# Altium project 2318_Métronome_Electronique.PrjPcb
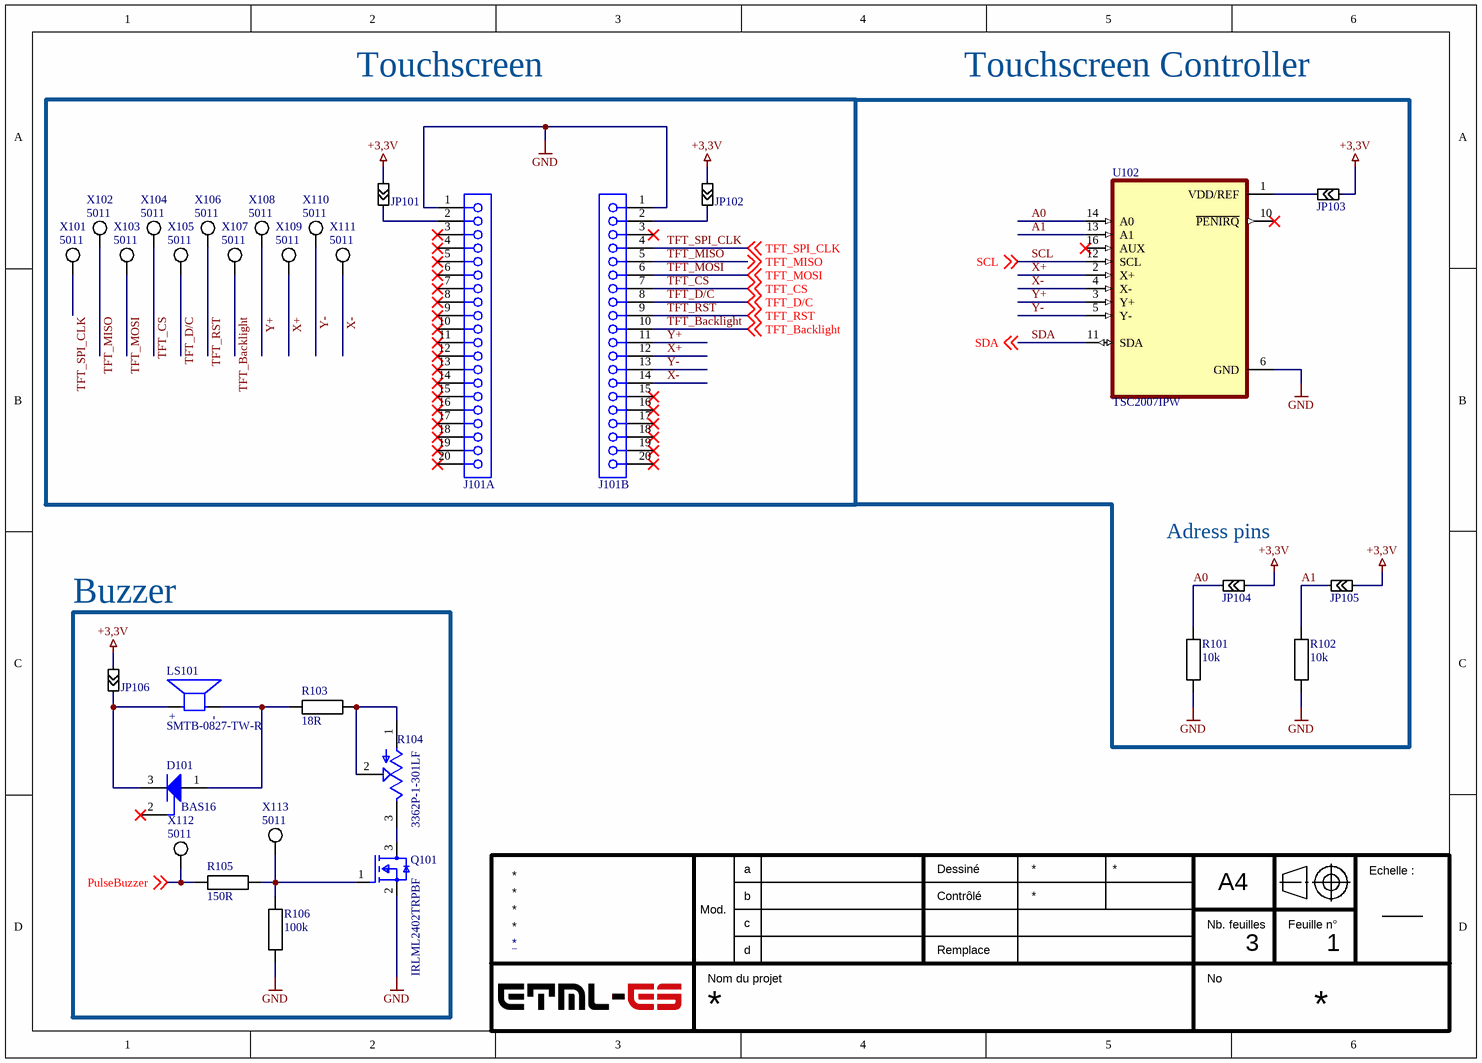
[diagram p0: General.SchDoc]
3 sheets, 125 parts. Net scope: global (net labels, ports and power ports of the same name join across sheets).
Board file: 2318_Metronome_A.PcbDoc
Sheets:
  General.SchDoc
  Microcontroleur.SchDoc
  Alimentation.SchDoc

## Sheet General.SchDoc
size 276 x 198 mm; SheetNumber: 1; SheetTotal: 3

### Parts
D101  BAS16  [INF-SOT23_L]
J101A  61302011821  [61302011821]  (value not drawn)
J101B  61302011821  [61302011821]  (value not drawn)
JP101  Jumper Pad  [Jumper SMD]  (value not drawn)
JP102  Jumper Pad  [Jumper SMD]  (value not drawn)
JP103  Jumper Pad  [Jumper SMD]  (value not drawn)
JP104  Jumper Pad  [Jumper SMD]  (value not drawn)
JP105  Jumper Pad  [Jumper SMD]  (value not drawn)
JP106  Jumper Pad  [Jumper SMD]  (value not drawn)
LS101  SMTB-0827-TW-R  [XDCR_SMTB-0827-TW-R]
Q101  IRLML2402TRPBF  [SOT95P237X112-3N]
R101  10k  [RESC2012X06M]
R102  10k  [RESC2012X06M]
R103  18R  [RESC2012X06M]
R104  3362P-1-301LF  [TRIM_3362P-1-301LF]
R105  150R  [RESC2012X06M]
R106  100k  [RESC2012X06M]
U102  TSC2007IPW  [SOP65P640X120-16N]
X101  5011  [Keystone_5011]
X102  5011  [Keystone_5011]
X103  5011  [Keystone_5011]
X104  5011  [Keystone_5011]
X105  5011  [Keystone_5011]
X106  5011  [Keystone_5011]
X107  5011  [Keystone_5011]
X108  5011  [Keystone_5011]
X109  5011  [Keystone_5011]
X110  5011  [Keystone_5011]
X111  5011  [Keystone_5011]
X112  5011  [Keystone_5011]
X113  5011  [Keystone_5011]

### Blocks framed on the sheet
Touchscreen: J101A J101B JP101 JP102 X101-X111
Buzzer: D101 JP106 LS101 Q101 R103-R106 X112 X113

### Nets
+3,3V: JP101.2 JP102.2 JP103.2 JP104.2 JP105.2 JP106.2
GND: J101A.1 J101B.1 Q101.2(S) R101.1 R102.1 R106.1 U102.6(GND)
A0: JP104.1 R101.2 U102.14(A0)
A1: JP105.1 R102.2 U102.13(A1)
PulseBuzzer: R105.1 X112.1(TP) ; off-sheet PulseBuzzer
SCL: U102.12(SCL) ; off-sheet SCL
SDA: U102.11(SDA) ; off-sheet SDA
TFT_Backlight: J101B.10 X107.1(TP) ; off-sheet TFT_Backlight
TFT_CS: J101B.7 X104.1(TP) ; off-sheet TFT_CS
TFT_D/C: J101B.8 X105.1(TP) ; off-sheet TFT_D/C
TFT_MISO: J101B.5 X102.1(TP) ; off-sheet TFT_MISO
TFT_MOSI: J101B.6 X103.1(TP) ; off-sheet TFT_MOSI
TFT_RST: J101B.9 X106.1(TP) ; off-sheet TFT_RST
TFT_SPI_CLK: J101B.4 X101.1(TP) ; off-sheet TFT_SPI_CLK
X+: J101B.12 U102.2(X+) X109.1(TP)
X-: J101B.14 U102.4(X-) X111.1(TP)
Y+: J101B.11 U102.3(Y+) X108.1(TP)
Y-: J101B.13 U102.5(Y-) X110.1(TP)
NetD101_1: D101.1(A) LS101.N(NEG) R103.2
NetD101_3: D101.3(K) JP106.1 LS101.P(POS)
NetJ101A_2: J101A.2 JP101.1
NetJ101B_2: J101B.2 JP102.1
NetJP103_1: JP103.1 U102.1(VDD/REF)
NetQ101_1: Q101.1(G) R105.2 R106.2 X113.1(TP)
NetQ101_3: Q101.3(D) R104.3(CW)
NetR103_1: R103.1 R104.1(CCW) R104.2(WIPER)

Not connected (* = marked no-connect by the designer): D101 2(NC)*; J101A 3* 4* 5* 6* 7* 8* 9* 10* 11* 12* 13* 14* 15* 16* 17* 18* 19* 20*; J101B 3* 15* 16* 17* 18* 19* 20*; U102 10(~{PENIRQ})* 16(AUX)*

### Notes on the sheet
- Touchscreen Controller
- Adress pins
- a
- Dessiné
- A4
- Echelle :
- Mod.
- b
- c
- d
- Contrôlé
- Remplace
- Nb. feuilles
- Feuille n°
- Nom du projet
- No
- (in symbol SMTB-0827-TW-R) +; -

### Library data of the parts
D101 = CMP-1176-00017-1: Silicon Switching Diode, SOT23, Reel, Green; Manufacturer: Infineon; VR (max): 80Â V; VBR (min): 85Â V; Configuration: Single; Green: TRUE; VF (max): 1.25Â V; trr (max): 4Â ns; IF (max): 250Â mA; IR (max): 100Â nA; ComponentLink3Description: Package Specification; PackageVersion: Apr-08; PackageReference: SOT23; ComponentLink2URL: http://www.infineon.com/dgdl/bas16series.pdf?folderId=db3a30431400ef6801141b5844e103ea&fileId=db3a30431400ef6801141b93811b03ff; Mounting Technology: Surface Mount; PartNumber: BAS16; ComponentLink2Description: Datasheet; ComponentLink1Description: Manufacturer URL; ComponentLink1URL: http://www.infineon.com/; ComponentLink3URL: http://www.infineon.com/dgdl/SOT23-Package_Overview.pdf?folderId=db3a30431936bc4b0119532290053c66&fileId=db3a30431936bc4b0119533468123c85; PackageDescription: 3-Pin Small Outline Transistor Package, 1.3 x 2.9 mm Body, 0.95 mm Pitch
J101A J101B = 61302011821: WR-PHD Socket Header, THT, Vertical, pitch 2.54mm, 1 Row, 20P; Manufacturer: Wurth Elektronik; Contact Resistance: 20mOhm; Rated Current: 3A; Working Voltage: 250V; Withstanding Voltage: 500V; Manufacturer Part Number: 61302011821; Category: Board-to-Board Connectors; Match Code: WR-PHD; ComponentLink1Description: Website Link; ComponentLink1URL: https://www.we-online.com/redexpert/article/61302011821?ad; ComponentLink2Description: Datasheet Link; ComponentLink2URL: https://www.we-online.com/redexpert/spec/61302011821?ad; Mount: Through Hole; Operating Temperature Max: 105°C; Operating Temperature Min: -40°C; Packaging: Tray; Gender: Socket Header; Number of Pins: 20; Number of Rows: 1; Orientation: Vertical; Pitch: 2.54mm
JP101-JP106 = Jumper Pad: SMD Jumper
LS101 = SMTB-0827-TW-R: SURFACE MOUNT TRANSDUCER 3.6 V0-P; MF: PUI Audio, Inc.; Purchase-URL: https://pricing.snapeda.com/search/part/SMTB-0827-TW-R/?ref=eda; Package: None; Digi-Key_Part_Number: 668-SMTB-0827-TW-RTR-ND; MP: SMTB-0827-TW-R; Check_prices: https://www.snapeda.com/parts/SMTB-0827-TW-R/PUI+Audio%252C+Inc./view-part/?ref=eda; SnapEDA_Link: https://www.snapeda.com/parts/SMTB-0827-TW-R/PUI+Audio%252C+Inc./view-part/?ref=snap; Value: *
Q101 = IRLML2402TRPBF: MOSFET N-CH 20V 1.2A SOT-23; Max Power Dissipation: 540mW; Gate to Source Voltage (Vgs): 12V; Drain to Source Resistance: 350mR; Rise Time: 9.5ns; Threshold Voltage: 700mV; Turn-On Delay Time: 2.5ns; Input Capacitance: 110pF; Element Configuration: Single; Power Dissipation: 540W; Turn-Off Delay Time: 9.7ns; Rds On Max: 250mR; REACH SVHC: No SVHC; Mount: Surface Mount; Packaging: Tape and Reel; Height: 0.04inch; Drain to Source Voltage (Vdss): 20V; Length: 0.119inch; Contact Plating: Tin; Continuous Drain Current (ID): 1.2A; Lead Free: Lead Free; Drain to Source Breakdown Voltage: 20V; Max Dual Supply Voltage: 20V; Number of Pins: 3; Halogen Free: Halogen Free; Max Operating Temperature: 150°C; Case/Package: SOT-23; Min Operating Temperature: -55°C; Width: 0.055inch
R101 R102 = CMP-066-000199-2: RES 10kohm  ±1% 0.125W 2012 (0805 INCH); Manufacturer Number: RC0805FR-0710KL; Manufacturer: Yageo; PN: PN-374909; TemperatureCoeff: ±200ppm/°C; Voltage: 150V; TemperatureRange: -55°C to 155°C; IsStocked: 1; Tolerance: ±1%; Category: Passives; Value: 10k; Supplier Price 1: 0.0200; Supplier Part Number 1: FAB.0805_R 10k; Supplier 1: ETML; SubCategory: Resistances couche epaisse; Power: 0.125W
R103 = CMP-066-000166-2: RES 18ohm  ±1% 0.125W 2012 (0805 INCH); Manufacturer: Yageo; Manufacturer Number: RC0805FR-0718RL; TemperatureRange: -55°C to 155°C; TemperatureCoeff: ±200ppm/°C; Voltage: 150V; Value: 18; PN: PN-496535; IsStocked: 1; Category: Passives; Power: 0.125W; Supplier Price 1: 0.0200; Tolerance: ±1%; Supplier 1: ETML; Supplier Part Number 1: FAB.0805_R 18R; SubCategory: Resistances couche epaisse
R104 = 3362P-1-301LF: 300 Ohms 0.5W, 1/2W PC Pins Through Hole Trimmer Potentiometer Cermet 1 Turn Top Adjustment; MF: Bourns; Package: 3362P-1 Bourns Inc.; Price: None; Availability: Bad; Check_prices: https://www.snapeda.com/parts/3362P-1-301LF/Bourns/view-part/620352/?ref=eda; MP: 3362P-1-301LF; SnapEDA_Link: https://www.snapeda.com/parts/3362P-1-301LF/Bourns/view-part/620352/?ref=snap; Value: *
R105 = CMP-066-000177-2: RES 150ohm  ±1% 0.125W 2012 (0805 INCH); Manufacturer: Yageo; Manufacturer Number: RC0805FR-07150RL; Value: 150; TemperatureRange: -55°C to 155°C; Voltage: 150V; TemperatureCoeff: ±200ppm/°C; PN: PN-455993; IsStocked: 1; Supplier Price 1: 0.0200; Tolerance: ±1%; SubCategory: Resistances couche epaisse; Power: 0.125W; Supplier Part Number 1: FAB.0805_R 150R; Supplier 1: ETML; Category: Passives
R106 = CMP-066-000211-2: RES 100kohm  ±1% 0.125W 2012 (0805 INCH); Manufacturer: Yageo; Manufacturer Number: RC0805FR-07100KL; TemperatureCoeff: ±200ppm/°C; Voltage: 150V; TemperatureRange: -55°C to 155°C; IsStocked: 1; PN: PN-903408; Category: Passives; Supplier Part Number 1: FAB.0805_R 100k; Value: 100k; Tolerance: ±1%; Supplier Price 1: 0.0200; Power: 0.125W; SubCategory: Resistances couche epaisse; Supplier 1: ETML
U102 = TSC2007IPW: 12-Bit, nanopower, 4-wire micro touch screen controller &nbsp; 16-TSSOP -40 to 85; MF: Texas Instruments; Digi-Key_Part_Number: 296-42398-2-ND; Purchase-URL: https://pricing.snapeda.com/search/part/TSC2007IPW/?ref=eda; Package: TSSOP-16 Texas Instruments; MP: TSC2007IPW; Value: *; SnapEDA_Link: https://www.snapeda.com/parts/TSC2007IPW/Texas%20Instruments/view-part/291616/?ref=snap; Check_prices: https://www.snapeda.com/parts/TSC2007IPW/Texas%20Instruments/view-part/291616/?ref=eda
X101-X113 = CMP-054-000005-1: TEST THT MULTIPURPOSE BK; Manufacturer: Keystone; IsStocked: True; PN: PN-926990; Supplier 1: ETML; Value: 5011; Manufacturer Number: 5011; Supplier Part Number 1: MAG.428.014; Category: Connectors; SubCategory: Testpoints; Supplier Price 1: 0.2439

## Sheet Microcontroleur.SchDoc
size 408 x 276 mm; SheetNumber: 2; SheetTotal: 3
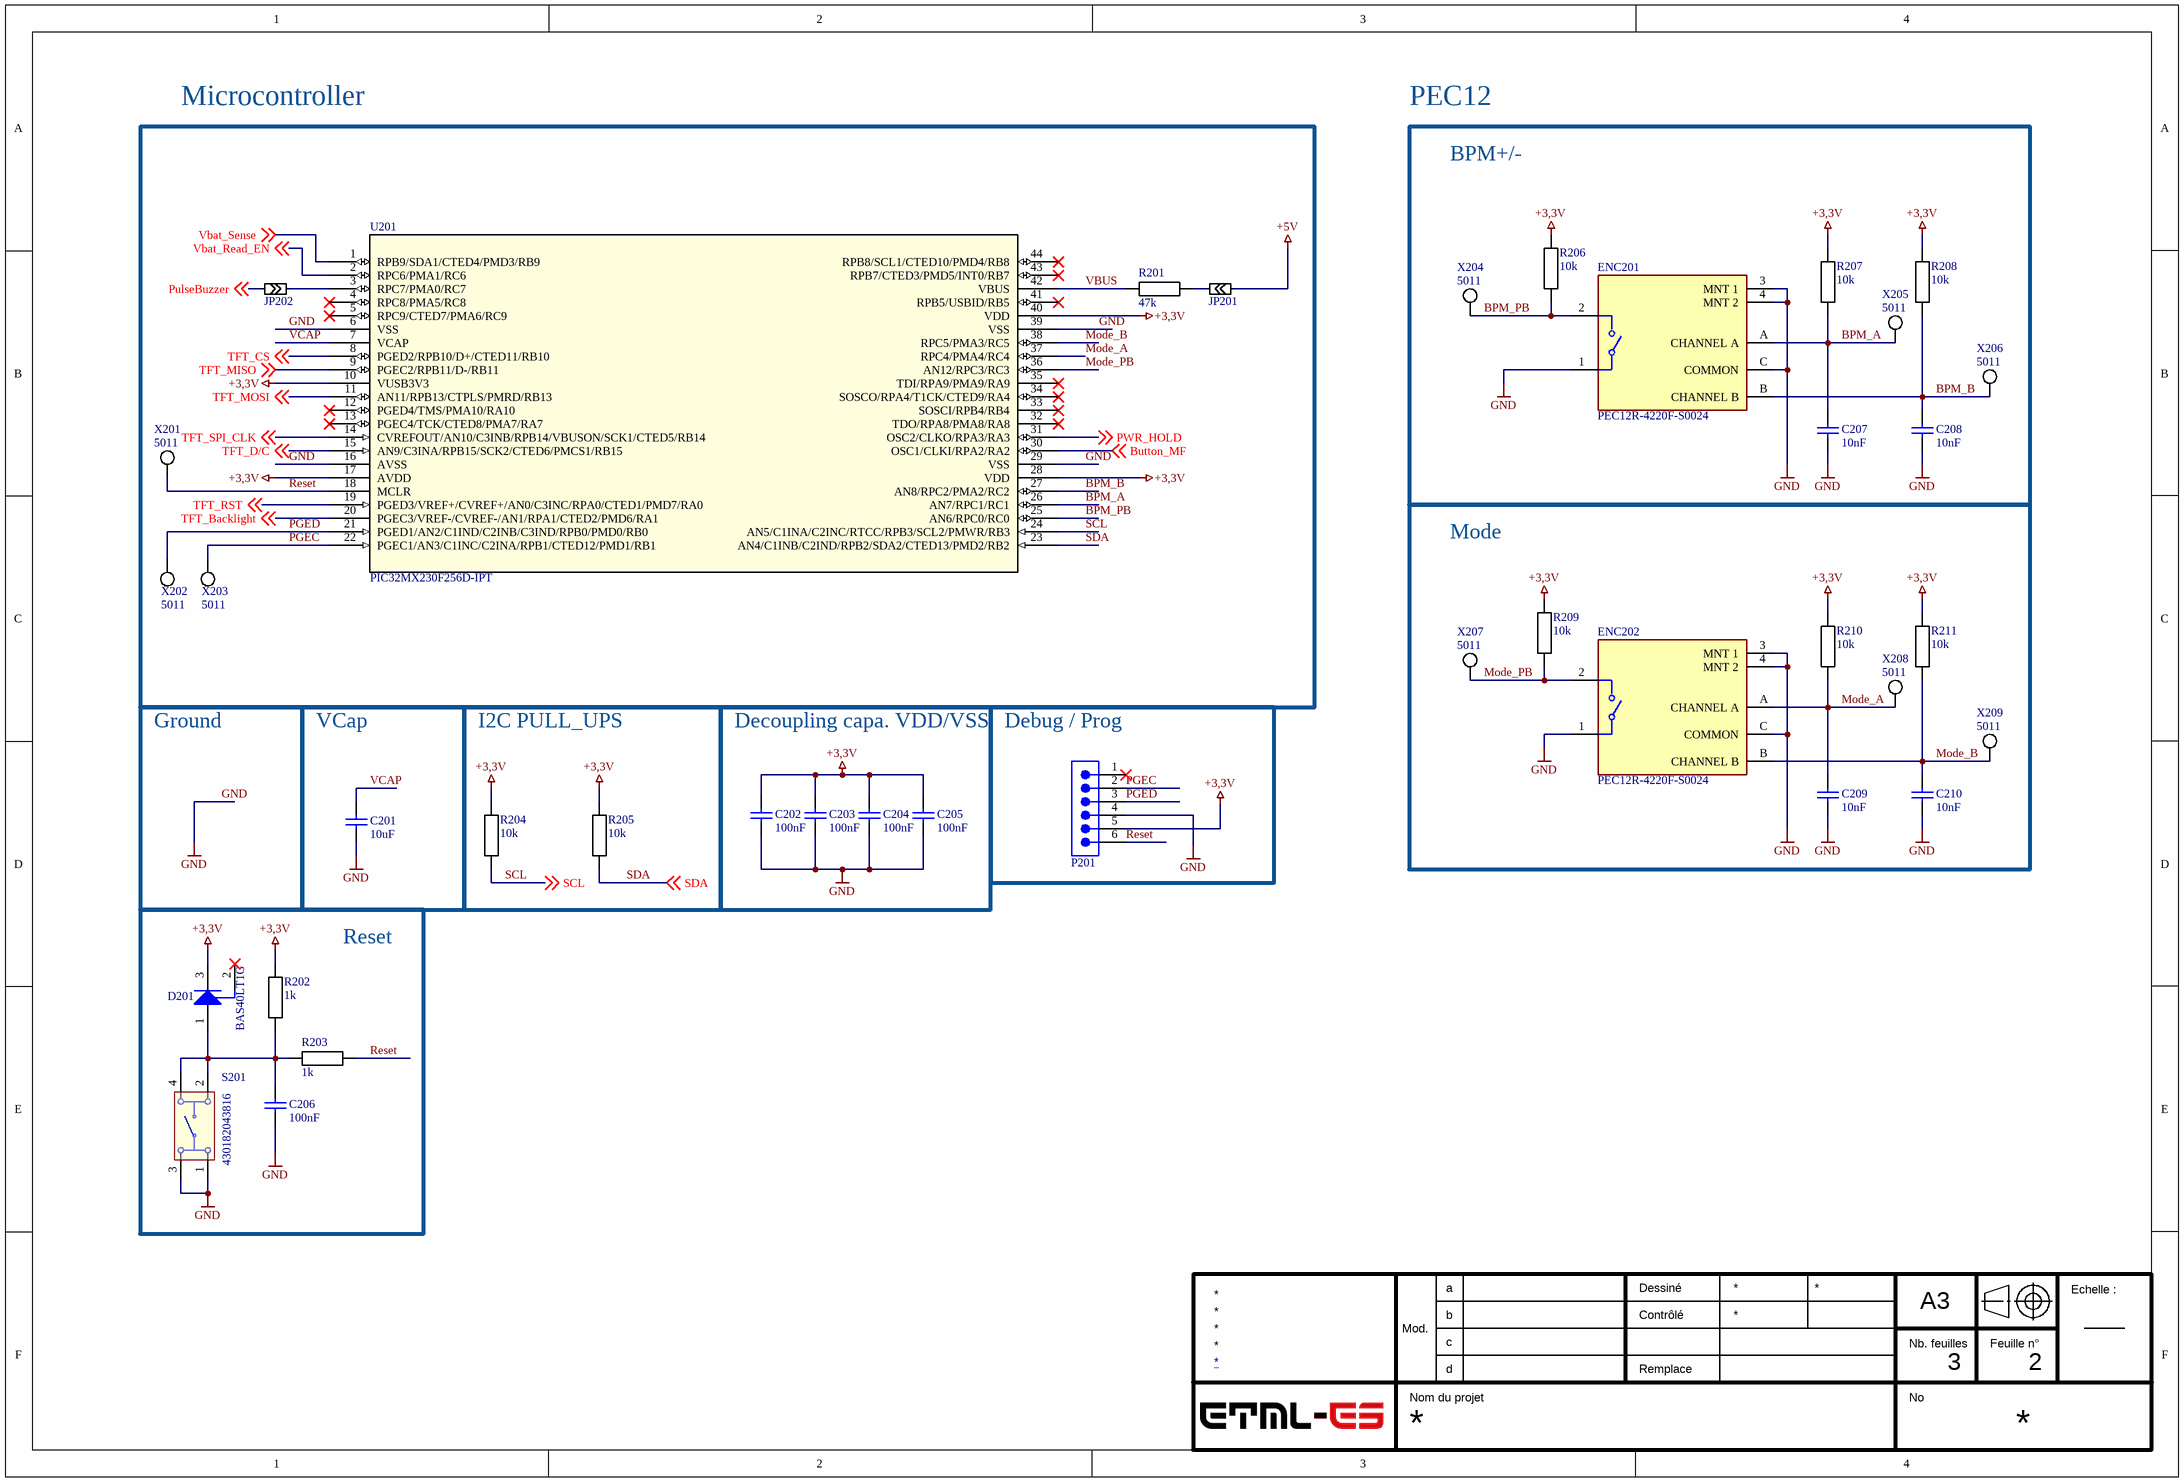
[diagram p1: Microcontroleur.SchDoc]

### Parts
C201  value 10uF  [CAPC2012X08M]  (hidden comment: Cap)
C202  value 100nF  [CAPC2012X08M]  (hidden comment: Cap)
C203  value 100nF  [CAPC2012X08M]  (hidden comment: Cap)
C204  value 100nF  [CAPC2012X08M]  (hidden comment: Cap)
C205  value 100nF  [CAPC2012X08M]  (hidden comment: Cap)
C206  value 100nF  [CAPC2012X08M]  (hidden comment: Cap)
C207  value 10nF  [CAPC2012X08M]  (hidden comment: Cap)
C208  value 10nF  [CAPC2012X08M]  (hidden comment: Cap)
C209  value 10nF  [CAPC2012X08M]  (hidden comment: Cap)
C210  value 10nF  [CAPC2012X08M]  (hidden comment: Cap)
D201  BAS40LT1G  [ONSC-SOT-23-3-318-08_V]
ENC201  PEC12R-4220F-S0024  [FP-PEC12R-4220F-S0024-MFG]
ENC202  PEC12R-4220F-S0024  [FP-PEC12R-4220F-S0024-MFG]
JP201  Jumper Pad  [Jumper SMD]  (value not drawn)
JP202  Jumper Pad  [Jumper SMD]  (value not drawn)
P201  61300611121  [61300611121]  (value not drawn)
R201  47k  [RESC2012X06M]
R202  1k  [RESC2012X06M]
R203  1k  [RESC2012X06M]
R204  10k  [RESC2012X06M]
R205  10k  [RESC2012X06M]
R206  10k  [RESC2012X06M]
R207  10k  [RESC2012X06M]
R208  10k  [RESC2012X06M]
R209  10k  [RESC2012X06M]
R210  10k  [RESC2012X06M]
R211  10k  [RESC2012X06M]
S201  430182043816  [430182043816]
U201  PIC32MX230F256D-IPT  [TQFP44_PT_MCH]
X201  5011  [Keystone_5011]
X202  5011  [Keystone_5011]
X203  5011  [Keystone_5011]
X204  5011  [Keystone_5011]
X205  5011  [Keystone_5011]
X206  5011  [Keystone_5011]
X207  5011  [Keystone_5011]
X208  5011  [Keystone_5011]
X209  5011  [Keystone_5011]

### Blocks framed on the sheet
Microcontroller: JP201 JP202 R201 U201 X201-X203
PEC12: C207-C210 ENC201 ENC202 R206-R211 X204-X209
VCap: C201
I2C PULL_UPS: R204 R205
Decoupling capa. VDD/VSS: C202-C205
Debug / Prog: P201
Reset: C206 D201 R202 R203 S201

### Nets
+3,3V: C202.2 C203.2 C204.2 C205.2 D201.3(K) P201.5 R202.2 R204.2 R205.2 R206.1 R207.2 R208.2 R209.1 R210.2 R211.2 U201.10(VUSB3V3) U201.17(AVDD) U201.28(VDD) U201.40(VDD)
+5V: JP201.2
GND: C201.1 C202.1 C203.1 C204.1 C205.1 C206.1 C207.1 C208.1 C209.1 C210.1 ENC201.1 ENC201.3(MNT_1) ENC201.4(MNT_2) ENC201.C(COMMON) ENC202.1 ENC202.3(MNT_1) ENC202.4(MNT_2) ENC202.C(COMMON) P201.4 S201.1 S201.3 U201.6(VSS) U201.16(AVSS) U201.29(VSS) U201.39(VSS)
BPM_A: C207.2 ENC201.A(CHANNEL_A) R207.1 U201.26(AN7/RPC1/RC1) X205.1(TP)
BPM_B: C208.2 ENC201.B(CHANNEL_B) R208.1 U201.27(AN8/RPC2/PMA2/RC2) X206.1(TP)
BPM_PB: ENC201.2 R206.2 U201.25(AN6/RPC0/RC0) X204.1(TP)
Button_MF: U201.30(OSC1/CLKI/RPA2/RA2) ; off-sheet Button_MF
Mode_A: C209.2 ENC202.A(CHANNEL_A) R210.1 U201.37(RPC4/PMA4/RC4) X208.1(TP)
Mode_B: C210.2 ENC202.B(CHANNEL_B) R211.1 U201.38(RPC5/PMA3/RC5) X209.1(TP)
Mode_PB: ENC202.2 R209.2 U201.36(AN12/RPC3/RC3) X207.1(TP)
PGEC: P201.2 U201.22(PGEC1/AN3/C1INC/C2INA/RPB1/CTED12/PMD1/RB1) X203.1(TP)
PGED: P201.3 U201.21(PGED1/AN2/C1IND/C2INB/C3IND/RPB0/PMD0/RB0) X202.1(TP)
PulseBuzzer: JP202.2 ; off-sheet PulseBuzzer
PWR_HOLD: U201.31(OSC2/CLKO/RPA3/RA3) ; off-sheet PWR_HOLD
Reset: P201.6 R203.1 U201.18(MCLR) X201.1(TP)
SCL: R204.1 U201.24(AN5/C1INA/C2INC/RTCC/RPB3/SCL2/PMWR/RB3) ; off-sheet SCL
SDA: R205.1 U201.23(AN4/C1INB/C2IND/RPB2/SDA2/CTED13/PMD2/RB2) ; off-sheet SDA
TFT_Backlight: U201.20(PGEC3/VREF-/CVREF-/AN1/RPA1/CTED2/PMD6/RA1) ; off-sheet TFT_Backlight
TFT_CS: U201.8(PGED2/RPB10/D+/CTED11/RB10) ; off-sheet TFT_CS
TFT_D/C: U201.15(AN9/C3INA/RPB15/SCK2/CTED6/PMCS1/RB15) ; off-sheet TFT_D/C
TFT_MISO: U201.9(PGEC2/RPB11/D-/RB11) ; off-sheet TFT_MISO
TFT_MOSI: U201.11(AN11/RPB13/CTPLS/PMRD/RB13) ; off-sheet TFT_MOSI
TFT_RST: U201.19(PGED3/VREF+/CVREF+/AN0/C3INC/RPA0/CTED1/PMD7/RA0) ; off-sheet TFT_RST
TFT_SPI_CLK: U201.14(CVREFOUT/AN10/C3INB/RPB14/VBUSON/SCK1/CTED5/RB14) ; off-sheet TFT_SPI_CLK
Vbat_Read_EN: U201.2(RPC6/PMA1/RC6) ; off-sheet Vbat_Read_EN
Vbat_Sense: U201.1(RPB9/SDA1/CTED4/PMD3/RB9) ; off-sheet Vbat_Sense
VBUS: R201.1 U201.42(VBUS)
VCAP: C201.2 U201.7(VCAP)
NetC206_2: C206.2 D201.1(A) R202.1 R203.2 S201.2 S201.4
NetJP201_1: JP201.1 R201.2
NetJP202_1: JP202.1 U201.3(RPC7/PMA0/RC7)

Not connected (* = marked no-connect by the designer): D201 2(NC)*; P201 1*; U201 4(RPC8/PMA5/RC8)* 5(RPC9/CTED7/PMA6/RC9)* 12(PGED4/TMS/PMA10/RA10)* 13(PGEC4/TCK/CTED8/PMA7/RA7)* 32(TDO/RPA8/PMA8/RA8)* 33(SOSCI/RPB4/RB4)* 34(SOSCO/RPA4/T1CK/CTED9/RA4)* 35(TDI/RPA9/PMA9/RA9)* 41(RPB5/USBID/RB5)* 43(RPB7/CTED3/PMD5/INT0/RB7)* 44(RPB8/SCL1/CTED10/PMD4/RB8)*

### Notes on the sheet
- BPM+/-
- Mode
- Ground
- a
- Dessiné
- A3
- Echelle :
- Mod.
- b
- c
- d
- Contrôlé
- Remplace
- Nb. feuilles
- Feuille n°
- Nom du projet
- No

### Library data of the parts
C201-C210 = Cap: Capacitor; Published: 8-Jun-2000; LatestRevisionDate: 17-Jul-2002; LatestRevisionNote: Re-released for DXP Platform.; PackageReference: RAD-0.3; Publisher: Altium Limited; PackageDescription: Radial Cap, Thru-Hole; 2 Leads; 0.3 in Pin Spacing
D201 = CMP-1055-00540-1: Schottky Barrier Diode, 3-Pin SOT-23, Pb-Free, Tape and Reel; Manufacturer: On Semiconductor; Configuration: Single; ComponentLink3Description: Package Specification; ComponentLink1URL: http://www.onsemi.com/; ComponentLink2Description: Datasheet; PackageDescription: 3-Pin Small Outline Transistor, Body 2.92 x 1.3 mm, Pitch 0.95 mm; ComponentLink3URL: http://www.onsemi.cn/pub_link/Collateral/318-08.PDF; PartNumber: BAS40LT1G; DatasheetVersion: Rev. 10; Packing: Tape and Reel; PackageReference: SOT-23-3-318-08; ComponentLink1Description: Manufacturer URL; ComponentLink2URL: http://www.onsemi.cn/pub_link/Collateral/BAS40LT1-D.PDF; RoHS: TRUE; Mounting Technology: Surface Mount; PackageVersion: Rev. AP, 11/2009
ENC201 ENC202 = CMP-07421-000021-1: ROTARY ENCODER MECHANICAL 24PPR; Built in Switch: Yes; Pulses per Revolution: 24; Output Type: Quadrature; Hole Diameter: 2mm; Number of Channels: 2; Max Supply Voltage (DC): 5V; RoHS Compliant: Yes; Max Operating Temperature: 70°C; Length: 26mm; Width: 12.5mm; Encoder Type: Mechanical; Series: PEC12R; Mount: Through Hole; Height: 13.4mm; Packaging: Bulk; Package Quantity: 150; Termination: PC Pin; Min Operating Temperature: -30°C; REACH SVHC: No SVHC; Detent: Yes; Orientation: Vertical
JP201 JP202 = Jumper Pad: SMD Jumper
P201 = 61300611121: WR-PHD Pin Header, THT, Vertical, pitch 2.54mm, 1 Row, 6P; Manufacturer: Wurth Elektronik; Contact Resistance: 20mOhm; Rated Current: 3A; Working Voltage: 250V; Withstanding Voltage: 500V; Manufacturer Part Number: 61300611121; Category: Board-to-Board Connectors; Match Code: WR-PHD; ComponentLink1Description: Website Link; ComponentLink1URL: https://www.we-online.com/redexpert/article/61300611121?ad; ComponentLink2Description: Datasheet Link; ComponentLink2URL: https://www.we-online.com/redexpert/spec/61300611121?ad; Mount: Through Hole; Operating Temperature Max: 105°C; Operating Temperature Min: -40°C; Packaging: Bag; Gender: Pin Header; Number of Pins: 6; Number of Rows: 1; Orientation: Vertical; Pitch: 2.54mm
R201 = CMP-066-000207-2: RES 47kohm  ±1% 0.125W 2012 (0805 INCH); Manufacturer Number: RC0805FR-0747KL; Manufacturer: Yageo; TemperatureRange: -55°C to 155°C; Voltage: 150V; IsStocked: 1; TemperatureCoeff: ±200ppm/°C; PN: PN-427242; Category: Passives; Supplier Price 1: 0.0200; Power: 0.125W; Supplier 1: ETML; Tolerance: ±1%; SubCategory: Resistances couche epaisse; Supplier Part Number 1: FAB.0805_R 47k; Value: 47k
R202 R203 = CMP-066-000187-2: RES 1.0kohm  ±1% 0.125W 2012 (0805 INCH); Manufacturer: Yageo; Manufacturer Number: RC0805FR-071KL; PN: PN-746409; TemperatureRange: -55°C to 155°C; IsStocked: 1; TemperatureCoeff: ±200ppm/°C; Voltage: 150V; Supplier 1: ETML; Value: 1k; SubCategory: Resistances couche epaisse; Supplier Price 1: 0.0200; Supplier Part Number 1: FAB.0805_R 1k0; Category: Passives; Tolerance: ±1%; Power: 0.125W
R204 R205 = CMP-066-000199-2: as R101 on sheet General; Tolerance: ±1%; Category: Passives; Value: 10k; Supplier Price 1: 0.0200; Supplier Part Number 1: FAB.0805_R 10k; Supplier 1: ETML; SubCategory: Resistances couche epaisse; Power: 0.125W
R206-R211 = R: Resistor 0805 M; Supplier 1: ETML; Supplier 1 Price: 0.00
S201 = CMP-1452-00013-1: WS-TASV SMD Tact Switch 6X6 mm; Manufacturer: Wuerth Elektronik; NoPins: 04; ComponentLink2Description: Datasheet; PackageReference: 430182043816; ComponentLink2URL: http://katalog.we-online.de/em/datasheet/4301x2.pdf; ComponentLink1URL: http://www.we-online.com; PartNumber: 430182043816; ComponentLink1Description: Manufacturer URL
U201 = PIC32MX230F256D-IPT: No Description Available; Mfr_Name: Microchip; RefDes: RefDes; Type: Type
X201-X209 = CMP-054-000005-1: as X101 on sheet General; Supplier 1: ETML; Value: 5011; Manufacturer Number: 5011; Supplier Part Number 1: MAG.428.014; Category: Connectors; SubCategory: Testpoints; Supplier Price 1: 0.2439

## Sheet Alimentation.SchDoc
size 408 x 276 mm; SheetNumber: 3; SheetTotal: 3
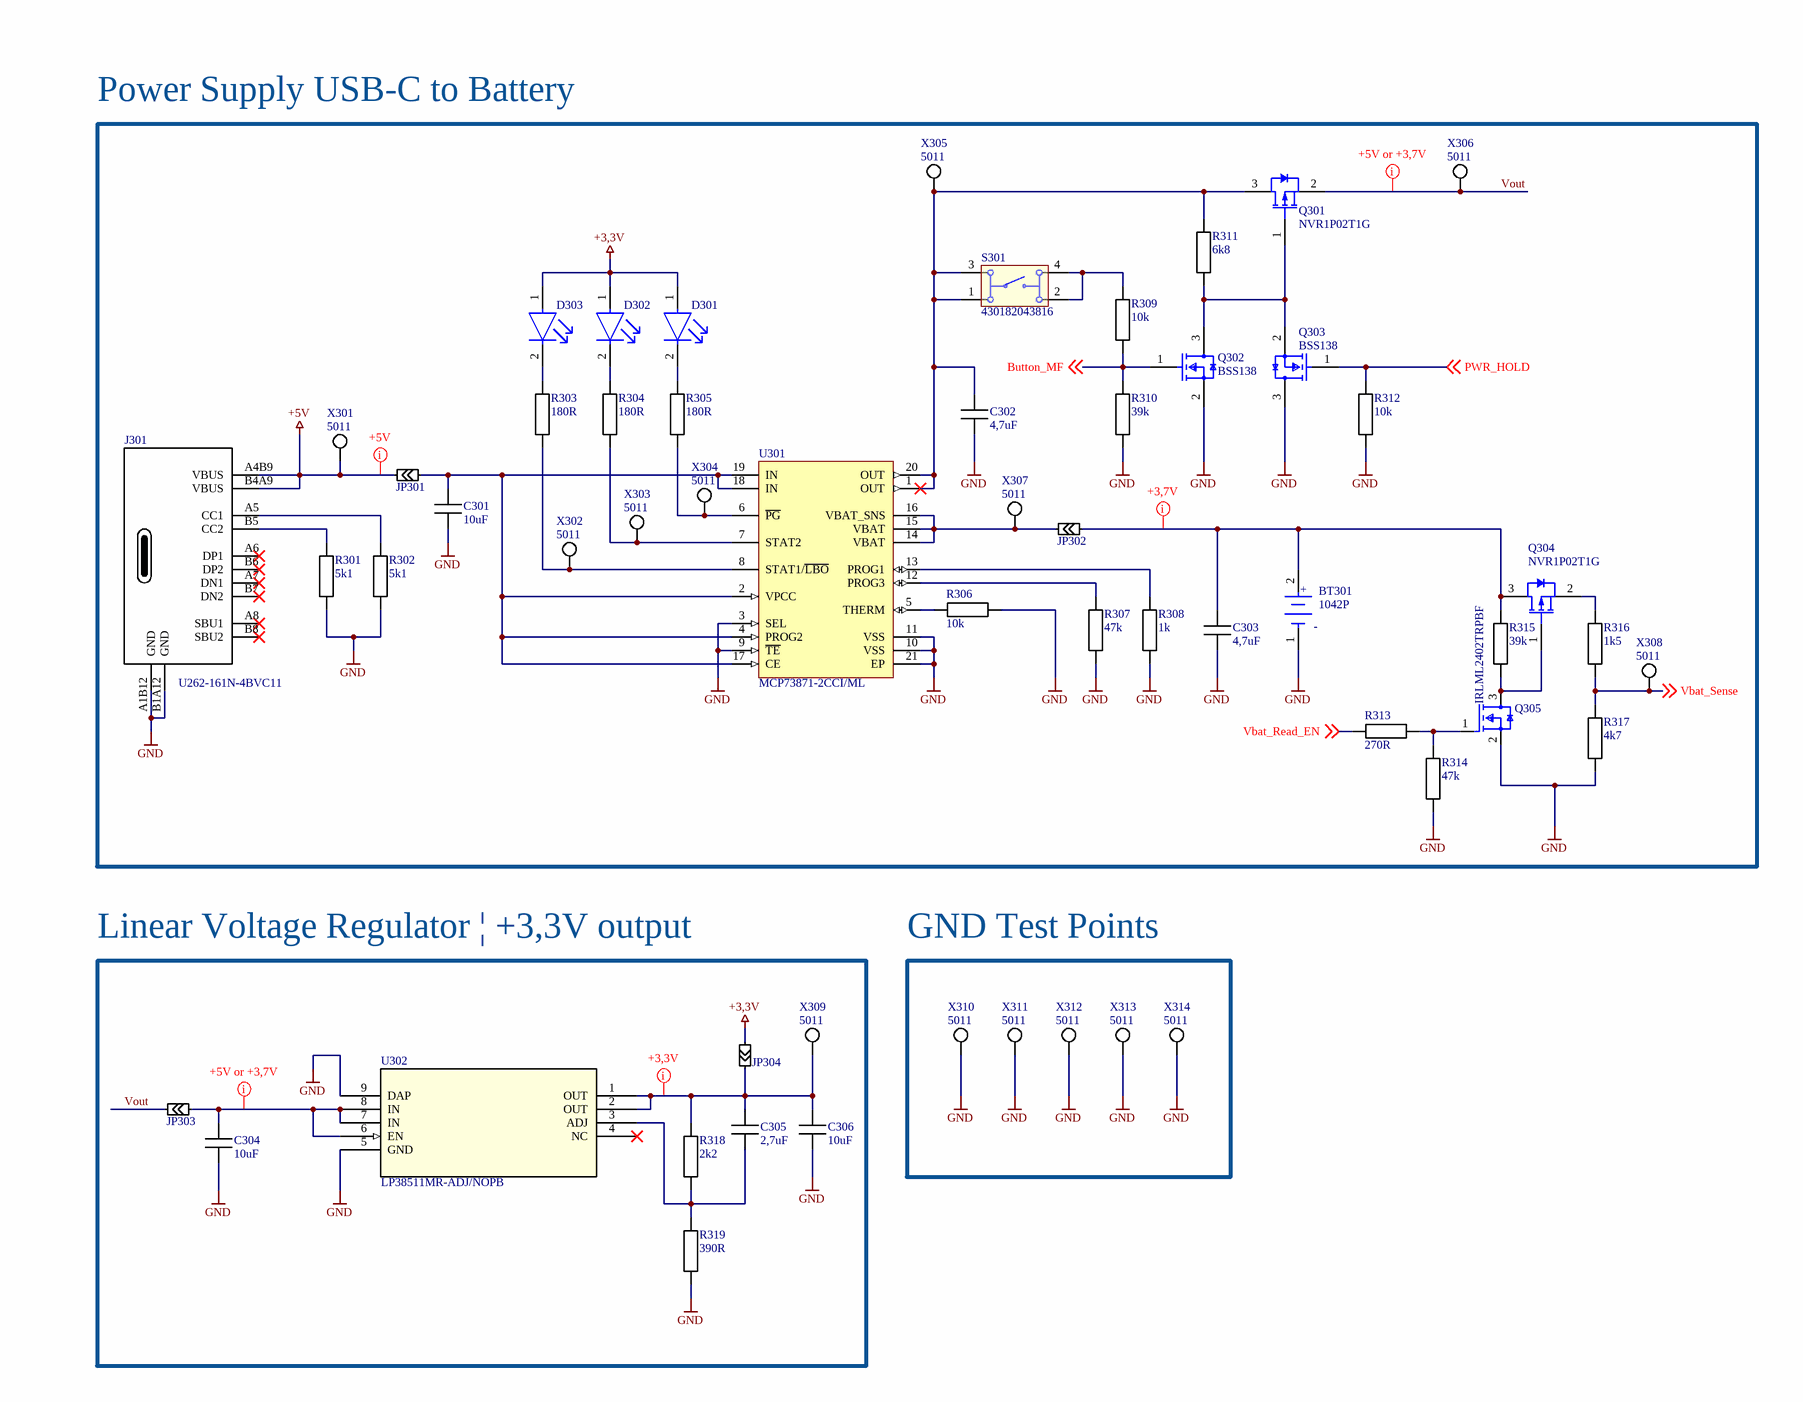
[diagram p2: Alimentation.SchDoc, right]

### Parts
BT301  1042P  [FP-1042P-MFG]
C301  10uF  [CAPC2012X08M]
C302  4,7uF  [CAPC2012X08M]
C303  4,7uF  [CAPC2012X08M]
C304  10uF  [CAPC2012X08M]
C305  2,7uF  [CAPC2012X08M]
C306  10uF  [CAPC2012X08M]
D301  LH R974-LP-1  [FP-LH_R974-MFG]  (value not drawn)
D302  LH R974-LP-1  [FP-LH_R974-MFG]  (value not drawn)
D303  LH R974-LP-1  [FP-LH_R974-MFG]  (value not drawn)
J301  U262-161N-4BVC11  [GCT_USB4105-GF-A]
JP301  Jumper Pad  [Jumper SMD]  (value not drawn)
JP302  Jumper Pad  [Jumper SMD]  (value not drawn)
JP303  Jumper Pad  [Jumper SMD]  (value not drawn)
JP304  Jumper Pad  [Jumper SMD]  (value not drawn)
Q301  NVR1P02T1G  [SOT95P237X112-3N]
Q302  BSS138  [SOT95P237X112-3N]
Q303  BSS138  [SOT95P237X112-3N]
Q304  NVR1P02T1G  [SOT95P237X112-3N]
Q305  IRLML2402TRPBF  [SOT95P237X112-3N]
R301  5k1  [RESC2012X06M]
R302  5k1  [RESC2012X06M]
R303  180R  [RESC2012X06M]
R304  180R  [RESC2012X06M]
R305  180R  [RESC2012X06M]
R306  10k  [RESC2012X06M]
R307  47k  [RESC2012X06M]
R308  1k  [RESC2012X06M]
R309  10k  [RESC2012X06M]
R310  39k  [RESC2012X06M]
R311  6k8  [RESC2012X06M]
R312  10k  [RESC2012X06M]
R313  270R  [RESC2012X06M]
R314  47k  [RESC2012X06M]
R315  39k  [RESC2012X06M]
R316  1k5  [RESC2012X06M]
R317  4k7  [RESC2012X06M]
R318  2k2  [RESC2012X06M]
R319  390R  [RESC2012X06M]
S301  430182043816  [430182043816]
U301  MCP73871-2CCI/ML  [QFN-ML20_M]
U302  LP38511MR-ADJ/NOPB  [MRA08B]
X301  5011  [Keystone_5011]
X302  5011  [Keystone_5011]
X303  5011  [Keystone_5011]
X304  5011  [Keystone_5011]
X305  5011  [Keystone_5011]
X306  5011  [Keystone_5011]
X307  5011  [Keystone_5011]
X308  5011  [Keystone_5011]
X309  5011  [Keystone_5011]
X310  5011  [Keystone_5011]
X311  5011  [Keystone_5011]
X312  5011  [Keystone_5011]
X313  5011  [Keystone_5011]
X314  5011  [Keystone_5011]

### Blocks framed on the sheet
Power Supply USB-C to Battery: BT301 C301-C303 D301-D303 J301 JP301 JP302 Q301-Q305 R301-R317 S301 U301 X301-X308
Linear Voltage Regulator | +3,3V output: C304-C306 JP303 JP304 R318 R319 U302 X309
GND Test Points: X310-X314

### Nets
+3,3V: D301.1(A) D302.1(A) D303.1(A) JP304.2
+5V: J301.A4B9(VBUS) J301.B4A9(VBUS) JP301.1 X301.1(TP)
GND: BT301.1(C) C301.1 C302.1 C303.1 C304.1 C306.1 J301.A1B12(GND) J301.B1A12(GND) Q302.2(S) Q303.3(D) Q305.2(S) R301.1 R302.1 R306.1 R307.2 R308.1 R310.1 R312.2 R314.1 R317.1 R319.1 U301.3(SEL) U301.9(~{TE}) U301.10(VSS) U301.11(VSS) U301.21(EP) U302.5(GND) U302.9(DAP) X310.1(TP) X311.1(TP) X312.1(TP) X313.1(TP) X314.1(TP)
Button_MF: Q302.1(G) R309.2 R310.2 ; off-sheet Button_MF
PWR_HOLD: Q303.1(G) R312.1 ; off-sheet PWR_HOLD
Vbat_Read_EN: R313.2 ; off-sheet Vbat_Read_EN
Vbat_Sense: R316.1 R317.2 X308.1(TP) ; off-sheet Vbat_Sense
Vout: JP303.1 Q301.2(S) X306.1(TP)
NetBT301_2: BT301.2(A) C303.2 JP302.2 Q304.3(D) R315.2
NetC301_2: C301.2 JP301.2 U301.2(VPCC) U301.4(PROG2) U301.17(CE) U301.18(IN) U301.19(IN)
NetC302_2: C302.2 Q301.3(D) R311.2 S301.1 S301.3 U301.1(OUT) U301.20(OUT) X305.1(TP)
NetC304_2: C304.2 JP303.2 U302.6(EN) U302.7(IN) U302.8(IN)
NetC305_1: C305.1 R318.1 R319.2 U302.3(ADJ)
NetC305_2: C305.2 C306.2 JP304.1 R318.2 U302.1(OUT) U302.2(OUT) X309.1(TP)
NetD301_2: D301.2(C) R305.2
NetD302_2: D302.2(C) R304.2
NetD303_2: D303.2(C) R303.2
NetJ301_A5: J301.A5(CC1) R302.2
NetJ301_B5: J301.B5(CC2) R301.2
NetJP302_1: JP302.1 U301.14(VBAT) U301.15(VBAT) U301.16(VBAT_SNS) X307.1(TP)
NetQ301_1: Q301.1(G) Q302.3(D) Q303.2(S) R311.1
NetQ304_1: Q304.1(G) Q305.3(D) R315.1
NetQ304_2: Q304.2(S) R316.2
NetQ305_1: Q305.1(G) R313.1 R314.2
NetR303_1: R303.1 U301.8(STAT1/~{LBO}) X302.1(TP)
NetR304_1: R304.1 U301.7(STAT2) X303.1(TP)
NetR305_1: R305.1 U301.6(~{PG}) X304.1(TP)
NetR306_2: R306.2 U301.5(THERM)
NetR307_1: R307.1 U301.12(PROG3)
NetR308_2: R308.2 U301.13(PROG1)
NetR309_1: R309.1 S301.2 S301.4

Not connected (* = marked no-connect by the designer): J301 A6(DP1)* A7(DN1)* A8(SBU1)* B6(DP2)* B7(DN2)* B8(SBU2)*; U302 4(NC)*

### Layout directives
mark named +5V or +3,7V: NetC304_2, Vout
mark named +3,7V: NetBT301_2
mark named +5V: +5V
mark named +3,3V: NetC305_2

### Notes on the sheet
- a
- Dessiné
- A3
- Echelle :
- Mod.
- b
- c
- d
- Contrôlé
- Remplace
- Nb. feuilles
- Feuille n°
- Nom du projet
- No
- (in symbol CMP-19636-000019-1) +; -

### Library data of the parts
BT301 = CMP-19636-000019-1: BATTERY HOLDER 18650 SMD TAB; Number of Cells: 1; Max Operating Temperature: 145°C; Termination: SMD/SMT; Mount: Surface Mount; Min Operating Temperature: -50°C; Package Quantity: 200; Packaging: Tray; Lead Free: Lead Free
C301 C304 C306 = CMP-065-000040-2: CAPC 10uF X5R 16V 10% 2012 (0805 INCH); Manufacturer Number: C2012X5R1C106K085AC; Manufacturer: TDK; IsStocked: 1; Value: 10µF; PN: PN-654987; TemperatureRange: -55°C to +85°C; Tolerance: ±10%; Voltage: 16V; SubCategory: Condensateurs ceramique; Dielectric: X5R; Supplier Part Number 1: FAB.0805_C 10u; Category: Passives; Supplier Price 1: 0.0360; Supplier 1: ETML
C302 C303 = CMP-065-000038-2: CAPC 4,7uF (0805 INCH); Manufacturer Number: C2012X7R1H104K085AA; Manufacturer: TDK; Voltage: 50V; Dielectric: X7R; IsStocked: 1; TemperatureRange: -55°C to +125°C; Tolerance: ±10%; PN: PN-747862; Supplier Part Number 1: FAB.0805_C 100n; Supplier Price 1: 0.0200; Value: 4,7uF; SubCategory: Condensateurs ceramique; Category: Passives; Supplier 1: ETML
C305 = CMP-065-000040-2: CAPC  2,7uF (0805 INCH); Manufacturer Number: C2012X5R1C106K085AC; Manufacturer: TDK; IsStocked: 1; Tolerance: ±10%; Voltage: 16V; PN: PN-654987; Dielectric: X5R; TemperatureRange: -55°C to +85°C; Value: 2,7uF; SubCategory: Condensateurs ceramique; Supplier Part Number 1: FAB.0805_C 10u; Category: Passives; Supplier Price 1: 0.0360; Supplier 1: ETML
D301-D303 = CMP-2000-06540-2: LED RED DIFFUSED 0805 SMD; Number of Elements: 1; Forward Voltage: 2.6V; Viewing Angle: 160°; Reverse Voltage: 5V; Test Current: 20mA; Dominant Wavelength: 645nm; Forward Current: 30mA; Luminous Intensity: 15mcd; Depth: 1.35mm; Min Operating Temperature: -30°C; Length: 2.1mm; Max Operating Temperature: 85°C; Radiation Hardening: No; Packaging: Tape and Reel; Number of Pins: 2; Mount: Surface Mount; Lens Style: Diffused
J301 = USB-C Type 2.0: U262-161N-4BVC11 / XKB Connectivity; ComponentLink1Description: LCSC  C319148; ComponentLink1URL: https://lcsc.com/product-detail/USB-Connectors_XKB-Connectivity-U262-161N-4BVC11_C319148.html; Supplier 1: LCSC; Supplier Part Number 1: C319148
JP301-JP304 = Jumper Pad: SMD Jumper
Q301 Q304 = CMP-1058-00745-1: Power MOSFET, -20 V, -1 A, P-Channel, 3-Pin SOT-23, Pb-Free, Tape and Reel; Manufacturer: On Semiconductor; Ciss Typ (pF): 165; Configuration: Single; VGS(th) Max (V): 2.3; Channel Polarity: P Channel; V(BR)DSS Min (V): 20; ID Max (A): 1; Coss Typ (pF): 110; Qrr Typ (nC): 8; Crss Typ (pF): 35; PD Max (W): 0.4; DatasheetVersion: Rev. 7; ComponentLink1Description: Manufacturer URL; PackageReference: SOT-23-3-318-08; ComponentLink2Description: Datasheet; ComponentLink2URL: http://www.onsemi.cn/pub_link/Collateral/NTR1P02T1-D.PDF; Packing: Tape and Reel; Package Type: SOT-23-3; ComponentLink1URL: http://www.onsemi.com/; RoHS: Pb-Free; PartNumber: NVR1P02T1G; PackageVersion: Rev. AP, 11/2009; PackageDescription: 3-Pin Small Outline Transistor, Body 2.92 x 1.3 mm, Pitch 0.95 mm; ComponentLink3URL: http://www.onsemi.cn/pub_link/Collateral/318-08.PDF; ComponentLink3Description: Package Specification; VGS Max (V): 20; Mounting Technology: Surface Mount; Manufacturer: ON Semiconductor; Manufacturer Part Number: NVR1P02T1G
Q302 Q303 = CMP-07173-000101-1: MOSFET N-CH 50V 220MA SOT-23; Manufacturer: ON Semiconductor / Fairchild; Turn-Off Delay Time: 20ns; Element Configuration: Single; Rds On Max: 3.5R; Gate to Source Voltage (Vgs): 20V; Threshold Voltage: 1.3V; Number of Elements: 1; Power Dissipation: 360mW; Rise Time: 9ns; Turn-On Delay Time: 2.5ns; Input Capacitance: 27pF; On-State Resistance: 6R; Lead Free: Lead Free; Length: 2.92mm; Width: 1.3mm; Drain to Source Breakdown Voltage: 50V; Min Operating Temperature: -55°C; REACH SVHC: No SVHC; Packaging: Tape and Reel; Radiation Hardening: No; Height: 0.93mm; Drain to Source Voltage (Vdss): 50V; Current Rating: 220mA; Voltage Rating (DC): 50V; Weight: 0.03g; Continuous Drain Current (ID): 220mA; Number of Pins: 3; Nominal Vgs: 1.3V; Max Power Dissipation: 360mW; Fall Time: 9ns; Drain to Source Resistance: 3.5R; Contact Plating: Tin; Case/Package: SOT-23; Package Quantity: 1; Dual Supply Voltage: 50V; Mount: Surface Mount; Termination: SMD/SMT; Max Operating Temperature: 150°C; Manufacturer Part Number: BSS138
Q305 = IRLML2402TRPBF: as Q101 on sheet General; REACH SVHC: No SVHC; Mount: Surface Mount; Packaging: Tape and Reel; Height: 0.04inch; Drain to Source Voltage (Vdss): 20V; Length: 0.119inch; Contact Plating: Tin; Continuous Drain Current (ID): 1.2A; Lead Free: Lead Free; Drain to Source Breakdown Voltage: 20V; Max Dual Supply Voltage: 20V; Number of Pins: 3; Halogen Free: Halogen Free; Max Operating Temperature: 150°C; Case/Package: SOT-23; Min Operating Temperature: -55°C; Width: 0.055inch
R301 R302 = CMP-066-000196-2: RES 5.1kohm (0805 INCH); Manufacturer: Yageo; Manufacturer Number: RC0805FR-075K1L; Power: 0.125W; Tolerance: ±1%; IsStocked: 1; PN: PN-467784; TemperatureRange: -55°C to 155°C; Value: 5.1k; Voltage: 150V; TemperatureCoeff: ±200ppm/°C; Supplier Part Number 1: FAB.0805_R 5k1; Supplier Price 1: 0.0800; Supplier 1: ES; Category: Passives; SubCategory: Resistances couche epaisse
R303-R305 = CMP-066-000178-2: RES 180ohm  ±1% 0.125W 2012 (0805 INCH); Manufacturer: Yageo; Manufacturer Number: RC0805FR-07180RL; Value: 180; TemperatureRange: -55°C to 155°C; TemperatureCoeff: ±200ppm/°C; PN: PN-125035; Voltage: 150V; IsStocked: 1; SubCategory: Resistances couche epaisse; Power: 0.125W; Tolerance: ±1%; Supplier 1: ETML; Supplier Price 1: 0.0200; Supplier Part Number 1: FAB.0805_R 180R; Category: Passives
R306 R309 R312 = CMP-066-000199-2: as R101 on sheet General; Tolerance: ±1%; Category: Passives; Value: 10k; Supplier Price 1: 0.0200; Supplier Part Number 1: FAB.0805_R 10k; Supplier 1: ETML; SubCategory: Resistances couche epaisse; Power: 0.125W
R307 R314 = CMP-066-000207-2: as R201 on sheet Microcontroleur; Category: Passives; Supplier Price 1: 0.0200; Power: 0.125W; Supplier 1: ETML; Tolerance: ±1%; SubCategory: Resistances couche epaisse; Supplier Part Number 1: FAB.0805_R 47k; Value: 47k
R308 = CMP-066-000187-2: as R202 on sheet Microcontroleur; Supplier 1: ETML; Value: 1k; SubCategory: Resistances couche epaisse; Supplier Price 1: 0.0200; Supplier Part Number 1: FAB.0805_R 1k0; Category: Passives; Tolerance: ±1%; Power: 0.125W
R310 R315 = CMP-066-000206-2: RES 39kohm  ±1% 0.125W 2012 (0805 INCH); Manufacturer: Yageo; Manufacturer Number: RC0805FR-0739KL; IsStocked: 1; TemperatureRange: -55°C to 155°C; TemperatureCoeff: ±200ppm/°C; PN: PN-758200; Voltage: 150V; Category: Passives; Value: 39k; Supplier Price 1: 0.0200; Power: 0.125W; SubCategory: Resistances couche epaisse; Supplier 1: ETML; Tolerance: ±1%; Supplier Part Number 1: FAB.0805_R 39k
R311 = CMP-066-000197-2: RES 6.8kohm  ±1% 0.125W 2012 (0805 INCH); Manufacturer Number: RC0805FR-076K8L; Manufacturer: Yageo; PN: PN-136826; TemperatureRange: -55°C to 155°C; Value: 6.8k; Voltage: 150V; TemperatureCoeff: ±200ppm/°C; IsStocked: 1; Category: Passives; SubCategory: Resistances couche epaisse; Supplier 1: ETML; Supplier Price 1: 0.0200; Power: 0.125W; Supplier Part Number 1: FAB.0805_R 6k8; Tolerance: ±1%
R313 = CMP-066-000180-2: RES 270ohm  ±1% 0.125W 2012 (0805 INCH); Manufacturer Number: RC0805FR-07270RL; Manufacturer: Yageo; Voltage: 150V; IsStocked: 1; Value: 270; TemperatureRange: -55°C to 155°C; TemperatureCoeff: ±200ppm/°C; PN: PN-363118; SubCategory: Resistances couche epaisse; Supplier Part Number 1: FAB.0805_R 270R; Category: Passives; Power: 0.125W; Supplier 1: ETML; Supplier Price 1: 0.0200; Tolerance: ±1%
R316 = CMP-066-000189-2: RES 1.5kohm  ±1% 0.125W 2012 (0805 INCH); Manufacturer Number: RC0805FR-071K5L; Manufacturer: Yageo; PN: PN-984492; Value: 1.5k; TemperatureRange: -55°C to 155°C; TemperatureCoeff: ±200ppm/°C; IsStocked: 1; Voltage: 150V; Supplier Price 1: 0.0200; Supplier Part Number 1: FAB.0805_R 1k5; Power: 0.125W; Supplier 1: ETML; Tolerance: ±1%; SubCategory: Resistances couche epaisse; Category: Passives
R317 = CMP-066-000195-2: RES 4.7kohm  ±1% 0.125W 2012 (0805 INCH); Manufacturer: Yageo; Manufacturer Number: RC0805FR-074K7L; Value: 4.7k; Voltage: 150V; IsStocked: 1; PN: PN-798742; TemperatureCoeff: ±200ppm/°C; TemperatureRange: -55°C to 155°C; Power: 0.125W; Supplier Price 1: 0.0200; Category: Passives; Supplier Part Number 1: FAB.0805_R 4k7; Supplier 1: ETML; SubCategory: Resistances couche epaisse; Tolerance: ±1%
R318 = CMP-066-000191-2: RES 2.2kohm  ±1% 0.125W 2012 (0805 INCH); Manufacturer Number: RC0805FR-072K2L; Manufacturer: Yageo; IsStocked: 1; Voltage: 150V; PN: PN-322576; Value: 2.2k; TemperatureCoeff: ±200ppm/°C; TemperatureRange: -55°C to 155°C; Supplier Price 1: 0.0200; SubCategory: Resistances couche epaisse; Supplier 1: ETML; Tolerance: ±1%; Category: Passives; Power: 0.125W; Supplier Part Number 1: FAB.0805_R 2k2
R319 = CMP-066-000182-2: RES 390ohm  ±1% 0.125W 2012 (0805 INCH); Manufacturer Number: RC0805FR-07390RL; Manufacturer: Yageo; Voltage: 150V; TemperatureCoeff: ±200ppm/°C; TemperatureRange: -55°C to 155°C; IsStocked: 1; Value: 390; PN: PN-601201; Tolerance: ±1%; Power: 0.125W; Supplier Part Number 1: FAB.0805_R 390R; Supplier 1: ETML; SubCategory: Resistances couche epaisse; Category: Passives; Supplier Price 1: 0.0200
S301 = CMP-1452-00013-1: as S201 on sheet Microcontroleur; ComponentLink2Description: Datasheet; PackageReference: 430182043816; ComponentLink2URL: http://katalog.we-online.de/em/datasheet/4301x2.pdf; ComponentLink1URL: http://www.we-online.com; PartNumber: 430182043816; ComponentLink1Description: Manufacturer URL
U301 = CMP-0133-00005-1: Stand-Alone System Load Sharing and Li-Ion/Li-Polymer Battery Charge Management Controller, 4.2V, 20-Pin QFN, Industrial Temperature; PackageDescription: 20-Lead Plastic Quad Flat, No Lead Package (ML) - 4x4x0.9 mm Body [QFN]; PackageReference: QFN-ML20; PackageVersion: revBB, Aug-2009; DatasheetVersion: revB, May-2009
U302 = LP38511MR-ADJ/NOPB: No Description Available; Mfr_Name: Texas Instruments; Copyright: Copyright (C) 2023 Ultra Librarian. All rights reserved.; Manufacturer_Part_Number: LP38511MR-ADJ/NOPB; RefDes: RefDes; Type: DEV
X301-X309 = CMP-054-000005-1: as X101 on sheet General; Supplier 1: ETML; Value: 5011; Manufacturer Number: 5011; Supplier Part Number 1: MAG.428.014; Category: Connectors; SubCategory: Testpoints; Supplier Price 1: 0.2439
X310-X314 = Test Point 5011: TEST THT MULTIPURPOSE BK, CMP-054-000005-1; Manufacturer: Keystone; Manufacturer: Keystone Electronics; IsStocked: True; PN: PN-926990; Supplier 1: ETML; Value: 5011; Manufacturer Number: 5011; Supplier Part Number 1: MAG.428.014; Category: Connectors; SubCategory: Testpoints; Supplier Price 1: 0.2439; Manufacturer Part Number: 5011; Component Type: Connectors

## Nets that join several sheets
+3,3V: General (6 pins), Microcontroleur (19 pins), Alimentation (D301.1 D302.1 D303.1 JP304.2)
+5V: Microcontroleur (JP201.2), Alimentation (J301.A4B9 J301.B4A9 JP301.1 X301.1)
GND: General (7 pins), Microcontroleur (25 pins), Alimentation (33 pins)
Button_MF: Microcontroleur (U201.30), Alimentation (Q302.1 R309.2 R310.2)
PulseBuzzer: General (R105.1 X112.1), Microcontroleur (JP202.2)
PWR_HOLD: Microcontroleur (U201.31), Alimentation (Q303.1 R312.1)
SCL: General (U102.12), Microcontroleur (R204.1 U201.24)
SDA: General (U102.11), Microcontroleur (R205.1 U201.23)
TFT_Backlight: General (J101B.10 X107.1), Microcontroleur (U201.20)
TFT_CS: General (J101B.7 X104.1), Microcontroleur (U201.8)
TFT_D/C: General (J101B.8 X105.1), Microcontroleur (U201.15)
TFT_MISO: General (J101B.5 X102.1), Microcontroleur (U201.9)
TFT_MOSI: General (J101B.6 X103.1), Microcontroleur (U201.11)
TFT_RST: General (J101B.9 X106.1), Microcontroleur (U201.19)
TFT_SPI_CLK: General (J101B.4 X101.1), Microcontroleur (U201.14)
Vbat_Read_EN: Microcontroleur (U201.2), Alimentation (R313.2)
Vbat_Sense: Microcontroleur (U201.1), Alimentation (R316.1 R317.2 X308.1)